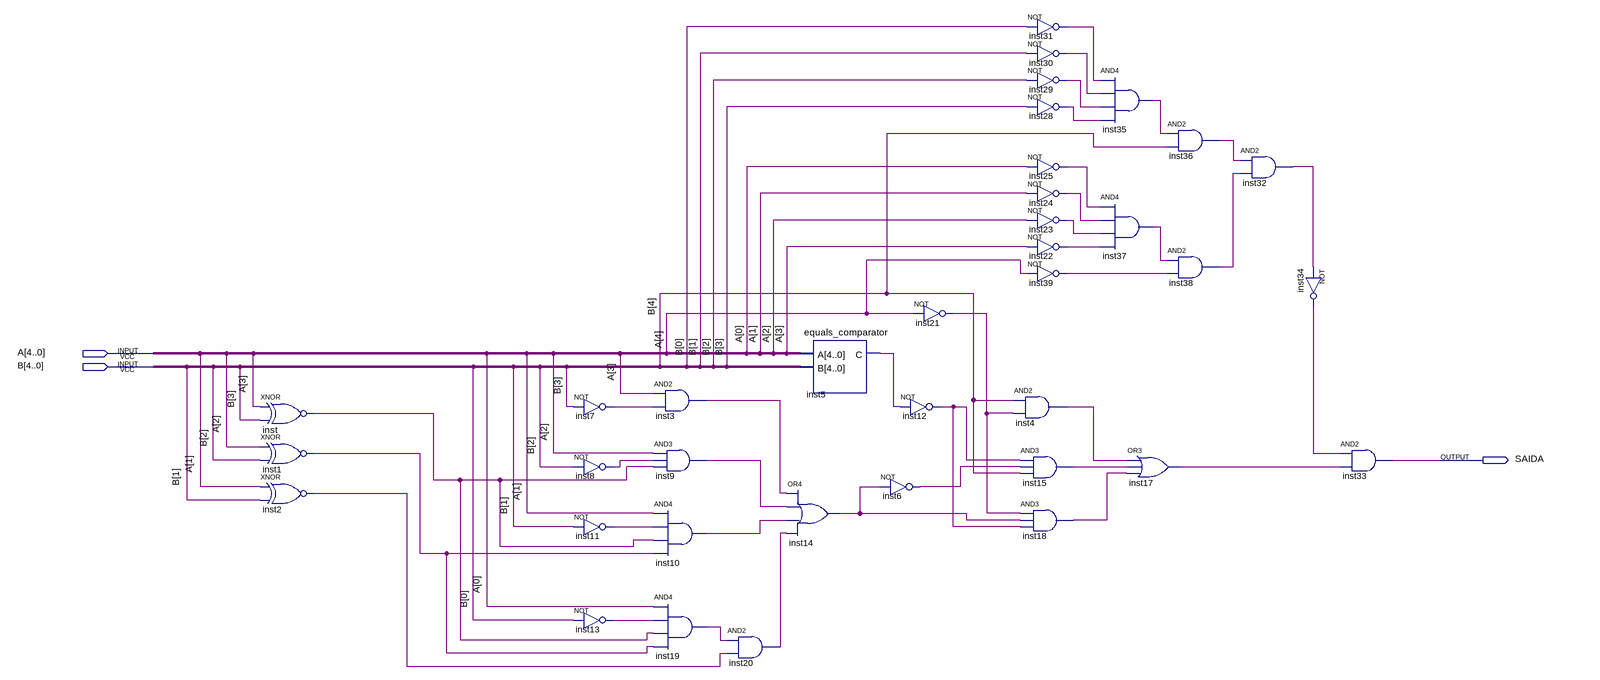
[diagram p0: schematic sheet]
// Quartus schematic greater_comparator.bdf as structural Verilog: 37 symbols, 3 pins
module greater_comparator (
  input  [4:0] A,
  input  [4:0] B,
  output SAIDA
);

  wire inst1_out, inst2_out, inst3_out, inst4_out, inst5_c, inst6_out, inst7_out, inst8_out, inst9_out,
       inst10_out, inst11_out, inst12_out, inst13_out, inst14_out, inst15_out, inst17_out, inst18_out,
       inst19_out, inst20_out, inst21_out, inst22_out, inst23_out, inst24_out, inst25_out, inst28_out,
       inst29_out, inst30_out, inst31_out, inst32_out, inst34_out, inst35_out, inst36_out, inst37_out,
       inst38_out, inst39_out, inst_out;

  xnor inst (inst_out, A[3], B[3]);
  xnor inst1 (inst1_out, A[2], B[2]);
  xnor inst2 (inst2_out, A[1], B[1]);
  not inst7 (inst7_out, B[3]);
  not inst8 (inst8_out, B[2]);
  not inst11 (inst11_out, B[1]);
  not inst13 (inst13_out, B[0]);
  and inst3 (inst3_out, A[3], inst7_out);
  and inst9 (inst9_out, A[2], inst8_out, inst_out);
  and inst10 (inst10_out, A[1], inst11_out, inst_out, inst1_out);
  and inst19 (inst19_out, A[0], inst13_out, inst_out, inst1_out);
  and inst20 (inst20_out, inst19_out, inst2_out);
  or inst14 (inst14_out, inst3_out, inst9_out, inst10_out, inst20_out);
  equals_comparator inst5 (.A(A), .B(B), .C(inst5_c));
  not inst12 (inst12_out, inst5_c);
  not inst6 (inst6_out, inst14_out);
  not inst21 (inst21_out, A[4]);
  not inst31 (inst31_out, B[0]);
  not inst30 (inst30_out, B[1]);
  not inst29 (inst29_out, B[2]);
  not inst28 (inst28_out, B[3]);
  not inst25 (inst25_out, A[0]);
  not inst24 (inst24_out, A[1]);
  not inst23 (inst23_out, A[2]);
  not inst22 (inst22_out, A[3]);
  not inst39 (inst39_out, A[4]);
  and inst4 (inst4_out, B[4], inst21_out);
  and inst15 (inst15_out, inst12_out, inst6_out, B[4]);
  and inst18 (inst18_out, inst21_out, inst14_out, inst12_out);
  and inst35 (inst35_out, inst31_out, inst30_out, inst29_out, inst28_out);
  and inst37 (inst37_out, inst25_out, inst24_out, inst23_out, inst22_out);
  and inst36 (inst36_out, inst35_out, B[4]);
  and inst38 (inst38_out, inst37_out, inst39_out);
  or inst17 (inst17_out, inst4_out, inst15_out, inst18_out);
  and inst32 (inst32_out, inst36_out, inst38_out);
  not inst34 (inst34_out, inst32_out);
  and inst33 (SAIDA, inst34_out, inst17_out);
endmodule
